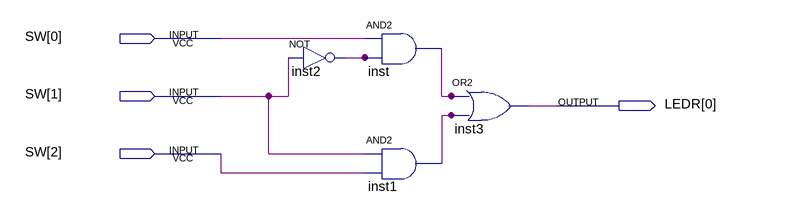
[diagram p0: schematic sheet]
// Quartus schematic Lab1_Part1_Schematic.bdf as structural Verilog: 4 symbols, 4 pins
module Lab1_Part1_Schematic (
  input  [2:0] SW,
  output [0:0] LEDR
);

  wire inst1_out, inst2_out, inst_out;

  not inst2 (inst2_out, SW[1]);
  and inst (inst_out, SW[0], inst2_out);
  and inst1 (inst1_out, SW[1], SW[2]);
  or inst3 (LEDR[0], inst_out, inst1_out);
endmodule
